# EAGLE design deska (EAGLE 7.7.0)
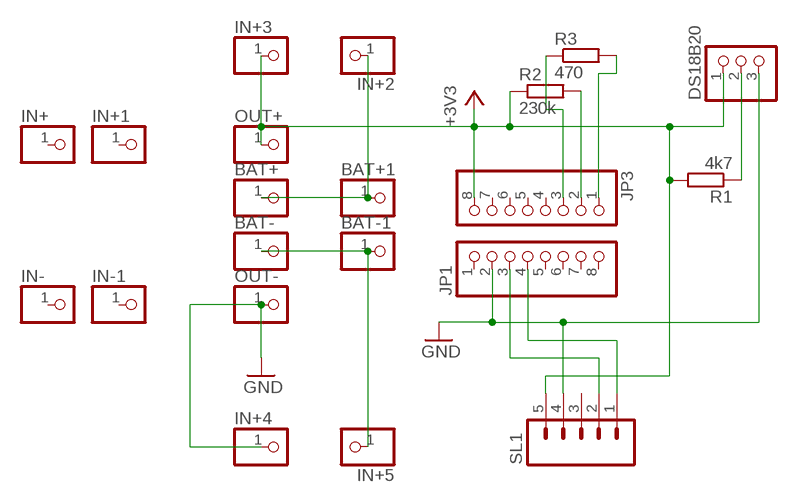
[diagram p0: schematic, sheet 1]

## Parts
BAT+  PINHD-1X1  [1X01]
BAT+1  PINHD-1X1  [1X01]
BAT-  PINHD-1X1  [1X01]
BAT-1  PINHD-1X1  [1X01]
DS18B20  PINHD-1X3  [1X03]
IN+  PINHD-1X1  [1X01]
IN+1  PINHD-1X1  [1X01]
IN+2  PINHD-1X1  [1X01]
IN+3  PINHD-1X1  [1X01]
IN+4  PINHD-1X1  [1X01]
IN+5  PINHD-1X1  [1X01]
IN-  PINHD-1X1  [1X01]
IN-1  PINHD-1X1  [1X01]
JP1  PINHD-1X8  [1X08]
JP3  PINHD-1X8  [1X08]
OUT+  PINHD-1X1  [1X01]
OUT-  PINHD-1X1  [1X01]
R1  4k7  R-EU_0204/7  [0204/7]
R2  230k  R-EU_0204/7  [0204/7]
R3  470  R-EU_0204/7  [0204/7]
SL1  M05  [05P]

## Nets
+3V3: DS18B20.1 IN+3.1 JP3.8 OUT+.1 R1.2 R2.1 SL1.5
GND: DS18B20.3 IN+4.1 JP1.2 OUT-.1 SL1.4
N$1: JP3.2 R2.2
N$2: DS18B20.2 R1.1
N$3: JP3.1 R3.2
N$4: JP3.3 R3.1
N$6: BAT+1.1 BAT+.1 IN+2.1
N$7: BAT-1.1 BAT-.1 IN+5.1
N$8: JP1.3 SL1.2
N$9: JP1.4 SL1.1
Unconnected: IN+1.1 IN+.1 IN-1.1 IN-.1 JP1.1 JP1.5 JP1.6 JP1.7 JP1.8 JP3.4 JP3.5 JP3.6 JP3.7 SL1.3

## Library data of the parts
BAT+ BAT+1 BAT- BAT-1 IN+ IN+1-IN+5 IN- IN-1 OUT+ OUT- = pinhead:PINHD-1X1: PIN HEADER
DS18B20 = pinhead:PINHD-1X3: PIN HEADER
JP1 JP3 = pinhead:PINHD-1X8: PIN HEADER
R1-R3 = rcl:R-EU_: RESISTOR, European symbol
SL1 = con-amp-quick:M05: AMP QUICK CONNECTOR; OC_FARNELL: unknown; OC_NEWARK: unknown

## Board
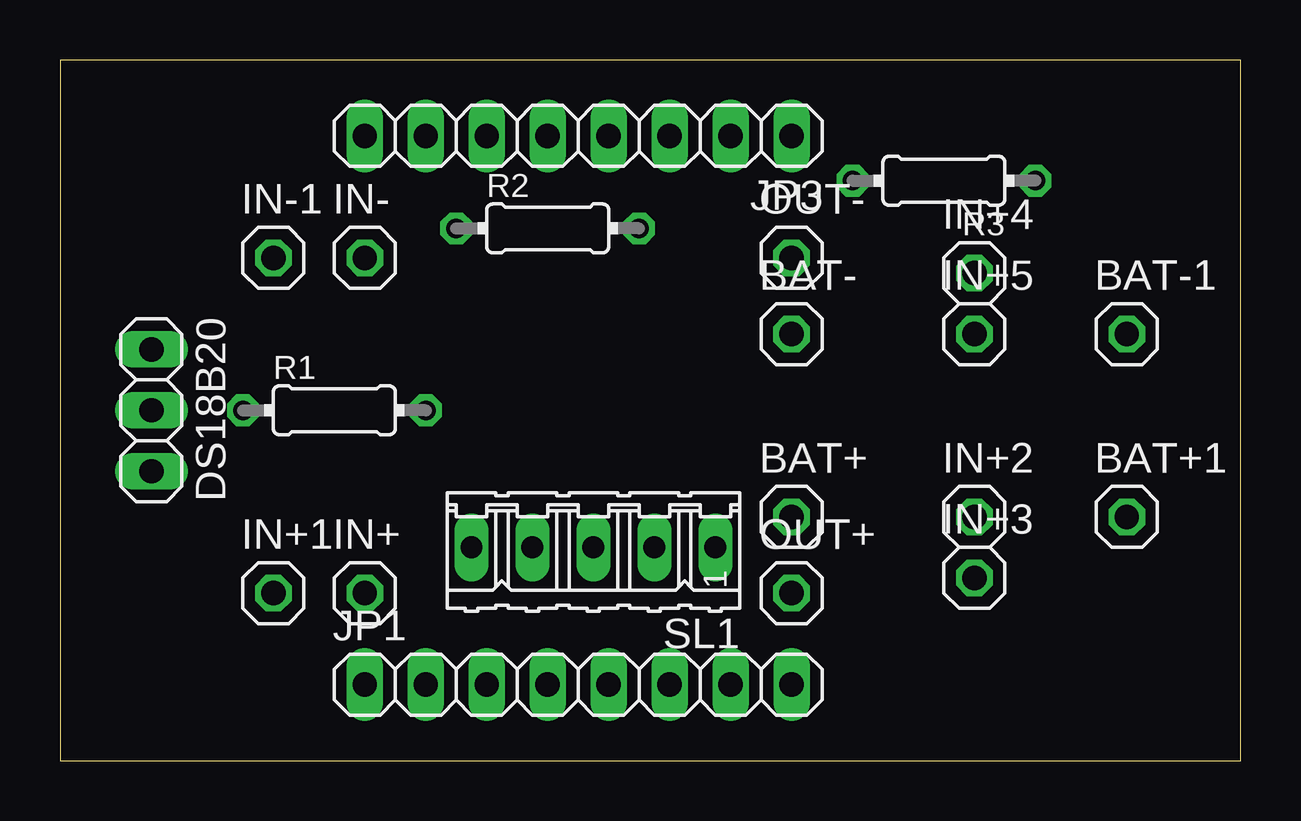
[diagram p1: board, top side]
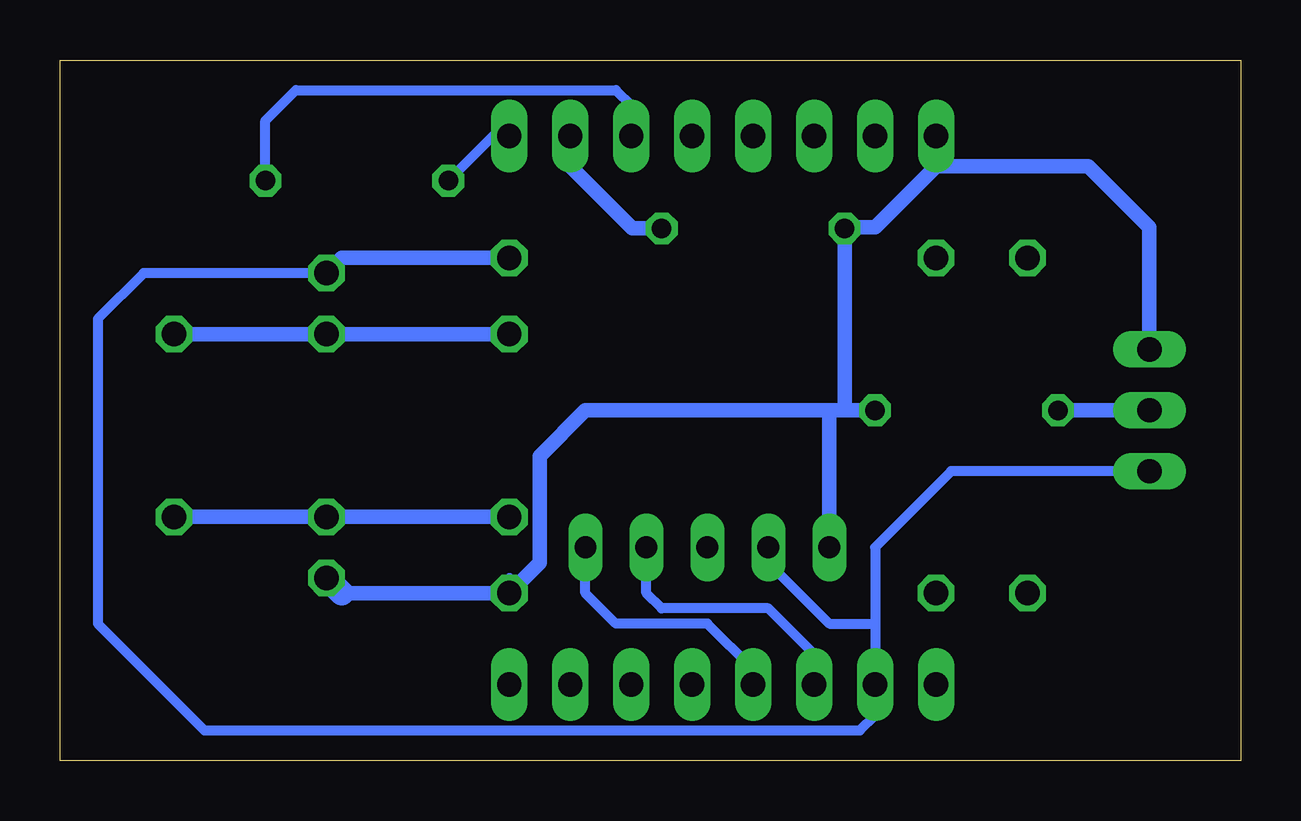
[diagram p2: board, bottom side, seen from below]

Size 49.2 x 29.2 mm. Coordinates in mm from the lower left corner, seen from the top.
Outline: 0,0 49.2,0 49.2,29.2 0,29.2 0,0
Copper layers (1*16): Top 0.035mm / dielectric 1.5mm / Bottom 0.035mm
Design rules "default": minimum track width 10mil, minimum drill 24mil, track to track 8mil, track to pad 8mil, pad to pad 8mil, via to via 8mil, smd to smd 8mil, copper to edge 40mil, drill to drill 8mil, minimum pad ring 10mil, minimum via ring 8mil, stop-mask expansion 4mil, vias tented up to drill 0mil, thermal gap 10mil

### Footprints (pad centres in the part's own frame; a part is rotated, then mirrored left to right if it is on the bottom)
1X01 = drill 1.016 octagon: 1 0,0
1X03 = drill 1.016 long: 1 -2.54,0; 2 0,0; 3 2.54,0
1X08 = drill 1.016 long: 1 -8.89,0; 2 -6.35,0; 3 -3.81,0; 4 -1.27,0; 5 1.27,0; 6 3.81,0; 7 6.35,0; 8 8.89,0
0204/7 = drill 0.813 octagon: 1 -3.81,0; 2 3.81,0
05P = drill 0.914 long: 1 -5.08,0; 2 -2.54,0; 3 0,0; 4 2.54,0; 5 5.08,0

### Placement (x,y rotation side)
BAT+  30.48,10.16 0 top
BAT+1  44.45,10.16 0 top
BAT-  30.48,17.78 0 top
BAT-1  44.45,17.78 0 top
DS18B20  3.81,14.61 270 top
IN+  12.7,6.98 0 top
IN+1  8.89,6.98 0 top
IN+2  38.1,10.16 0 top
IN+3  38.1,7.62 0 top
IN+4  38.1,20.32 0 top
IN+5  38.1,17.78 0 top
IN-  12.7,20.95 0 top
IN-1  8.89,20.95 0 top
JP1  21.59,3.17 0 top
JP3  21.59,26.04 180 top
OUT+  30.48,6.98 0 top
OUT-  30.48,20.95 0 top
R1  11.43,14.61 0 top
R2  20.32,22.18 0 top
R3  36.83,24.17 180 top
SL1  22.23,8.89 180 top

### Tracks (layer width: path | path; a pad name or v marks a point on that pad's centre or on a via)
+3V3
  Bottom 0.406: OUT+.1 30.48,7.62
  Bottom 0.61: JP3.8 12.7,24.77 | 12.7,24.77 6.35,24.77 3.81,22.23 DS18B20.1 | R1.2 16.51,14.61 | 16.51,14.61 17.14,14.61 | SL1.5 17.14,14.61 | 16.51,14.61 R2.1 16.47,22.23 15.24,22.23 12.7,24.77 | 37.47,6.98 OUT+.1 29.21,8.25 29.21,12.7 27.3,14.61 17.14,14.61
  Bottom 1.016: 37.47,6.98 IN+3.1
GND
  Top 0.254: 15.32,3.33 JP1.2 14.63,3.79
  Bottom 0.406: DS18B20.3 12.06,12.07 15.24,8.89 15.24,5.71 | 15.24,5.71 JP1.2 15.24,1.9 15.88,1.27 43.18,1.27 47.62,5.71 47.62,18.41 45.72,20.32 IN+4.1 | SL1.4 19.68,8.25 17.14,5.71 15.24,5.71
  Bottom 0.61: OUT-.1 37.47,20.95 IN+4.1
N$1
  Bottom 0.61: R2.2 25.36,22.18 27.94,24.77 JP3.2
N$2
  Bottom 0.61: R1.1 DS18B20.2
N$3
  Bottom 0.406: JP3.1 31.16,26.04 R3.2
N$4
  Bottom 0.406: R3.1 40.64,26.67 39.37,27.94 26.04,27.94 25.4,27.3 JP3.3
N$6
  Bottom 0.61: BAT+.1 IN+2.1 BAT+1.1
N$7
  Bottom 0.61: BAT-.1 IN+5.1 BAT-1.1
N$8
  Bottom 0.406: JP1.3 17.78,4.45 19.68,6.35 24.13,6.35 24.77,6.98 SL1.2
N$9
  Bottom 0.406: JP1.4 20.32,3.81 22.23,5.71 26.04,5.71 27.3,6.98 SL1.1